# EAGLE design ton-bot (EAGLE 7.4.0)
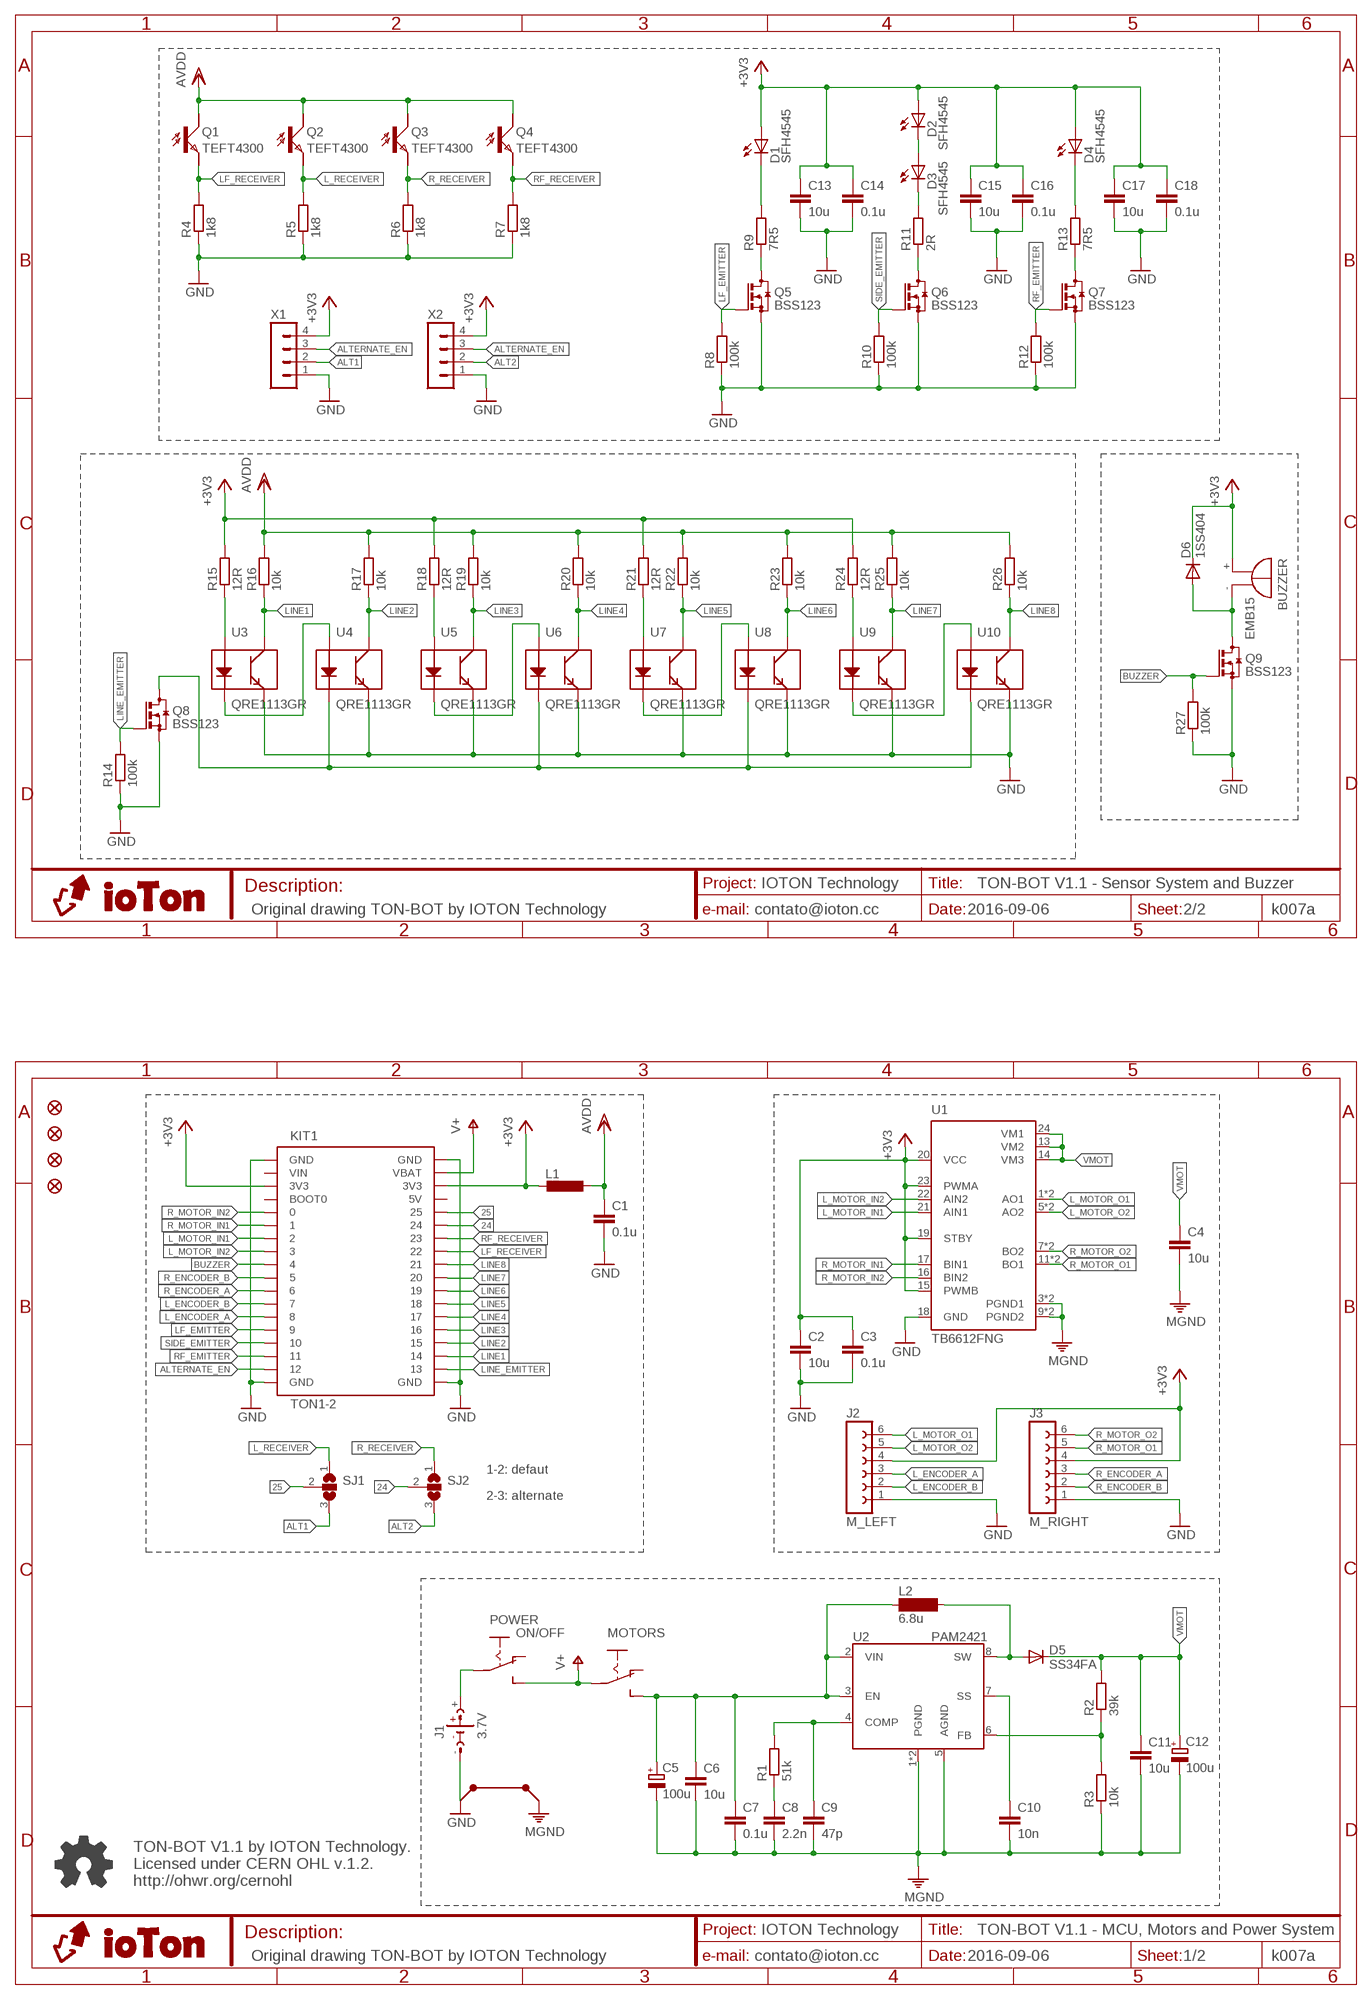
[diagram p0: schematic, sheet 1]

## Parts
BUZZER  EMB15  BMT1205XH7.5  [BMT1205XH7.5]
C1  0.1u  C-EUC0603  [C0603]
C2  10u  C-EUC0805  [C0805]
C3  0.1u  C-EUC0603  [C0603]
C4  10u  C-EUC0805  [C0805]
C5  100u  CPOL-EU153CLV-0505  [153CLV-0505]
C6  10u  C-EUC0805  [C0805]
C7  0.1u  C-EUC0603  [C0603]
C8  2.2n  C-EUC0603  [C0603]
C9  47p  C-EUC0603  [C0603]
C10  10n  C-EUC0603  [C0603]
C11  10u  C-EUC0805  [C0805]
C12  100u  CPOL-EU153CLV-0505  [153CLV-0505]
C13  10u  C-EUC0805  [C0805]
C14  0.1u  C-EUC0603  [C0603]
C15  10u  C-EUC0805  [C0805]
C16  0.1u  C-EUC0603  [C0603]
C17  10u  C-EUC0805  [C0805]
C18  0.1u  C-EUC0603  [C0603]
D1  SFH4545  SFH4545AK  [SFH4545-AK]
D2  SFH4545  SFH4545KA  [SFH4545-KA]
D3  SFH4545  SFH4545KA  [SFH4545-KA]
D4  SFH4545  SFH4545KA  [SFH4545-KA]
D5  SS34FA  DIODE-DO214BA  [DO214BA]
D6  1SS404  DIODE-SOD323-R  [SOD323-R]
J1  3.7V  BATTERY  [BATTERY]
J2  M_LEFT  FE06-12MM  [CON6-1_2MM]
J3  M_RIGHT  FE06-12MM  [CON6-1_2MM]
JP1  FIDUCIAL1X2  [FIDUCIAL-1X2]
JP2  FIDUCIAL1X2  [FIDUCIAL-1X2]
JP3  FIDUCIAL1X2  [FIDUCIAL-1X2]
JP4  FIDUCIAL1X2  [FIDUCIAL-1X2]
KIT1  TON1-2  [TON1-2]
L1  L-EUL0603  [L0603]
L2  6.8u  TYS6045  [TYS6045]
MOTORS  SWITCHS  [SWITCH]
POWER  ON/OFF  SWITCHS  [SWITCH]
Q1  TEFT4300  TEFT4300CE  [TEFT4300-CE]
Q2  TEFT4300  TEFT4300EC  [TEFT4300-EC]
Q3  TEFT4300  TEFT4300CE  [TEFT4300-CE]
Q4  TEFT4300  TEFT4300EC  [TEFT4300-EC]
Q5  BSS123  [SOT23]
Q6  BSS123  [SOT23]
Q7  BSS123  [SOT23]
Q8  BSS123  [SOT23]
Q9  BSS123  [SOT23]
R1  51k  R-EU_R0603  [R0603]
R2  39k  R-EU_R0603  [R0603]
R3  10k  R-EU_R0603  [R0603]
R4  1k8  R-EU_R0603  [R0603]
R5  1k8  R-EU_R0603  [R0603]
R6  1k8  R-EU_R0603  [R0603]
R7  1k8  R-EU_R0603  [R0603]
R8  100k  R-EU_R0603  [R0603]
R9  7R5  R-EU_R0805  [R0805]
R10  100k  R-EU_R0603  [R0603]
R11  2R  R-EU_R0805  [R0805]
R12  100k  R-EU_R0603  [R0603]
R13  7R5  R-EU_R0805  [R0805]
R14  100k  R-EU_R0603  [R0603]
R15  12R  R-EU_R0603  [R0603]
R16  10k  R-EU_R0603  [R0603]
R17  10k  R-EU_R0603  [R0603]
R18  12R  R-EU_R0603  [R0603]
R19  10k  R-EU_R0603  [R0603]
R20  10k  R-EU_R0603  [R0603]
R21  12R  R-EU_R0603  [R0603]
R22  10k  R-EU_R0603  [R0603]
R23  10k  R-EU_R0603  [R0603]
R24  12R  R-EU_R0603  [R0603]
R25  10k  R-EU_R0603  [R0603]
R26  10k  R-EU_R0603  [R0603]
R27  100k  R-EU_R0603  [R0603]
SJ1  SJ2W  [SJ_2]
SJ2  SJ2W  [SJ_2]
U1  TB6612FNG  [SSOP24]
U2  PAM2421  PAM242X  [SO-08EP]
U3  QRE1113GR  QRE1113  [QRE1113]
U4  QRE1113GR  QRE1113  [QRE1113]
U5  QRE1113GR  QRE1113  [QRE1113]
U6  QRE1113GR  QRE1113  [QRE1113]
U7  QRE1113GR  QRE1113  [QRE1113]
U8  QRE1113GR  QRE1113  [QRE1113]
U9  QRE1113GR  QRE1113  [QRE1113]
U10  QRE1113GR  QRE1113  [QRE1113]
X1  MA04-1  [PIN4-1]
X2  MA04-1  [PIN4-1]

## Nets
24: KIT1.EXT-2.6 SJ2.2
25: KIT1.EXT-2.5 SJ1.2
+3V3: BUZZER.+ C2.1 C3.1 C13.1 C14.1 C15.1 C16.1 C17.1 C18.1 D1.A D2.A D4.A D6.C J2.4 J3.4 KIT1.EXT-1.3(3V3) KIT1.EXT-2.3(3V3) L1.2 R15.2 R18.2 R21.2 R24.2 U1.15(PWMB) U1.19(STBY) U1.20(VCC) U1.23(PWMA) X1.4 X2.4
A_VDD: C1.1 L1.1 Q1.C Q2.C Q3.C Q4.C R16.2 R17.2 R19.2 R20.2 R22.2 R23.2 R25.2 R26.2 ; supply symbol labelled AVDD
ALT1: SJ1.3 X1.2
ALT2: SJ2.3 X2.2
ALTERNATE_EN: KIT1.EXT-1.17 X1.3 X2.3
BUZZER: KIT1.EXT-1.9 Q9.1(G) R27.2
FDSG: D5.A L2.2 U2.8(SW)
GND: C1.2 C2.2 C3.2 C13.2 C14.2 C15.2 C16.2 C17.2 C18.2 J1.- J2.1 J3.1 KIT1.EXT-1.1(GND) KIT1.EXT-1.18(GND) KIT1.EXT-2.1(GND) KIT1.EXT-2.18(GND) KIT1.GND1(GND) KIT1.GND2(GND) Q5.2(S) Q6.2(S) Q7.2(S) Q8.2(S) Q9.2(S) R4.1 R5.1 R6.1 R7.1 R8.1 R10.1 R12.1 R14.1 R27.1 U1.18(GND) U3.4(E) U4.4(E) U5.4(E) U6.4(E) U7.4(E) U8.4(E) U9.4(E) U10.4(E) X1.1 X2.1
L_ENCODER_A: J2.3 KIT1.EXT-1.13
L_ENCODER_B: J2.2 KIT1.EXT-1.12
L_MOTOR_IN1: KIT1.EXT-1.7 U1.21(AIN1)
L_MOTOR_IN2: KIT1.EXT-1.8 U1.22(AIN2)
L_MOTOR_O1: J2.6 U1.1(AO1) U1.2(AO1)
L_MOTOR_O2: J2.5 U1.5(AO2) U1.6(AO2)
L_RECEIVER: Q2.E R5.2 SJ1.1
LF_EMITTER: KIT1.EXT-1.14 Q5.1(G) R8.2
LF_RECEIVER: KIT1.EXT-2.8 Q1.E R4.2
LINE1: KIT1.EXT-2.16 R16.1 U3.3(C)
LINE2: KIT1.EXT-2.15 R17.1 U4.3(C)
LINE3: KIT1.EXT-2.14 R19.1 U5.3(C)
LINE4: KIT1.EXT-2.13 R20.1 U6.3(C)
LINE5: KIT1.EXT-2.12 R22.1 U7.3(C)
LINE6: KIT1.EXT-2.11 R23.1 U8.3(C)
LINE7: KIT1.EXT-2.10 R25.1 U9.3(C)
LINE8: KIT1.EXT-2.9 R26.1 U10.3(C)
LINE_EMITTER: KIT1.EXT-2.17 Q8.1(G) R14.2
LINE_K: Q8.3(D) U4.2(K) U6.2(K) U8.2(K) U10.2(K)
M_GND: C4.2 C5.- C6.2 C7.2 C8.2 C9.2 C10.2 C11.2 C12.- R3.1 U1.3(PGND1) U1.4(PGND1) U1.9(PGND2) U1.10(PGND2) U2.1(PGND) U2.5(AGND) U2.EXP(PGND) ; supply symbol labelled MGND
N$1: Q5.3(D) R9.1
N$2: Q6.3(D) R11.1
N$3: Q7.3(D) R13.1
N$4: BUZZER.- D6.A Q9.3(D)
N$8: R2.1 R3.2 U2.6(FB)
N$9: C10.1 U2.7(SS)
N$11: C8.1 R1.1
N$12: C9.1 R1.2 U2.4(COMP)
N$14: D2.K D3.A
N$15: D1.K R9.2
N$16: D4.K R13.2
N$17: J1.+ POWER.P
N$20: D3.K R11.2
N$33: R15.1 U3.1(A)
N$34: U3.2(K) U4.1(A)
N$35: U5.2(K) U6.1(A)
N$36: U7.2(K) U8.1(A)
N$37: U9.2(K) U10.1(A)
N$39: R24.1 U9.1(A)
N$42: R21.1 U7.1(A)
N$55: R18.1 U5.1(A)
R_ENCODER_A: J3.3 KIT1.EXT-1.11
R_ENCODER_B: J3.2 KIT1.EXT-1.10
R_MOTOR_IN1: KIT1.EXT-1.6 U1.17(BIN1)
R_MOTOR_IN2: KIT1.EXT-1.5 U1.16(BIN2)
R_MOTOR_O1: J3.5 U1.11(BO1) U1.12(BO1)
R_MOTOR_O2: J3.6 U1.7(BO2) U1.8(BO2)
R_RECEIVER: Q3.E R6.2 SJ2.1
RF_EMITTER: KIT1.EXT-1.16 Q7.1(G) R12.2
RF_RECEIVER: KIT1.EXT-2.7 Q4.E R7.2
SIDE_EMITTER: KIT1.EXT-1.15 Q6.1(G) R10.2
V+: KIT1.EXT-2.2(VBAT) MOTORS.P POWER.S
VIN_M: C5.+ C6.1 C7.1 L2.1 MOTORS.S U2.2(VIN) U2.3(EN)
VMOT: C4.1 C11.1 C12.+ D5.C R2.2 U1.13(VM2) U1.14(VM3) U1.24(VM1)
Unconnected: KIT1.EXT-1.4(BOOT0) MOTORS.O POWER.O

## Notes on the sheet
- TON-BOT V1.1 - Sensor System and Buzzer
- Original drawing TON-BOT by IOTON Technology | k007a
- 1-2: defaut
- 2-3: alternate
- TON-BOT V1.1 by IOTON Technology.
  Licensed under CERN OHL v.1.2.
  http://ohwr.org/cernohl
- TON-BOT V1.1 - MCU, Motors and Power System
- Original drawing TON-BOT by IOTON Technology | k007a

## Power pins joined to a net without a drawn wire
5V: KIT1.EXT-2.4(5V)
VIN: KIT1.EXT-1.2(VIN)

## Library data of the parts
BUZZER = buzzer:BMT1205XH7.5: MAGNETIC TRANSDUCER Source: Http:www.be-star.com; OC_FARNELL: unknown; OC_NEWARK: unknown
C1-C4 C6-C11 C13-C18 = rcl:C-EU: CAPACITOR, European symbol
C5 C12 = rcl:CPOL-EU: POLARIZED CAPACITOR, European symbol
D1-D4 = maze:SFH4545
D5 D6 = diode:DIODE-: DIODE
J1 = pololu:BATTERY: BATTERY CLIP
J2 J3 = pololu:FE06-1: FEMALE HEADER
JP1-JP4 = SparkFun:FIDUCIAL: Fiducial Alignment Points Various fiducial points for machine vision alignment.
KIT1 = ioton:TON1-2
L1 = rcl:L-EU: INDUCTOR, European symbol
L2 = ioton:TYS6045: INDUCTOR SMD power inductor; OC_FARNELL: unknown; OC_NEWARK: unknown
MOTORS POWER = pololu:SWITCH: SLIDING SWITCH 0.1" spacing through hole, vertical SPDT slide switch http://www.ladyada.net/library/pcb/eaglelibrary.html
Q1-Q4 = maze:TEFT4300
Q5-Q9 = transistor-small-signal:BSS123: N-CHANNEL MOS FET
R1-R27 = rcl:R-EU_: RESISTOR, European symbol
SJ1 SJ2 = jumper:SJ2W: SMD solder JUMPER
U1 = pololu:TB6612FNG
U2 = ioton:PAM242X
U3-U10 = pololu:QRE1113
X1 X2 = pololu:MA04-1: PIN HEADER

## Board
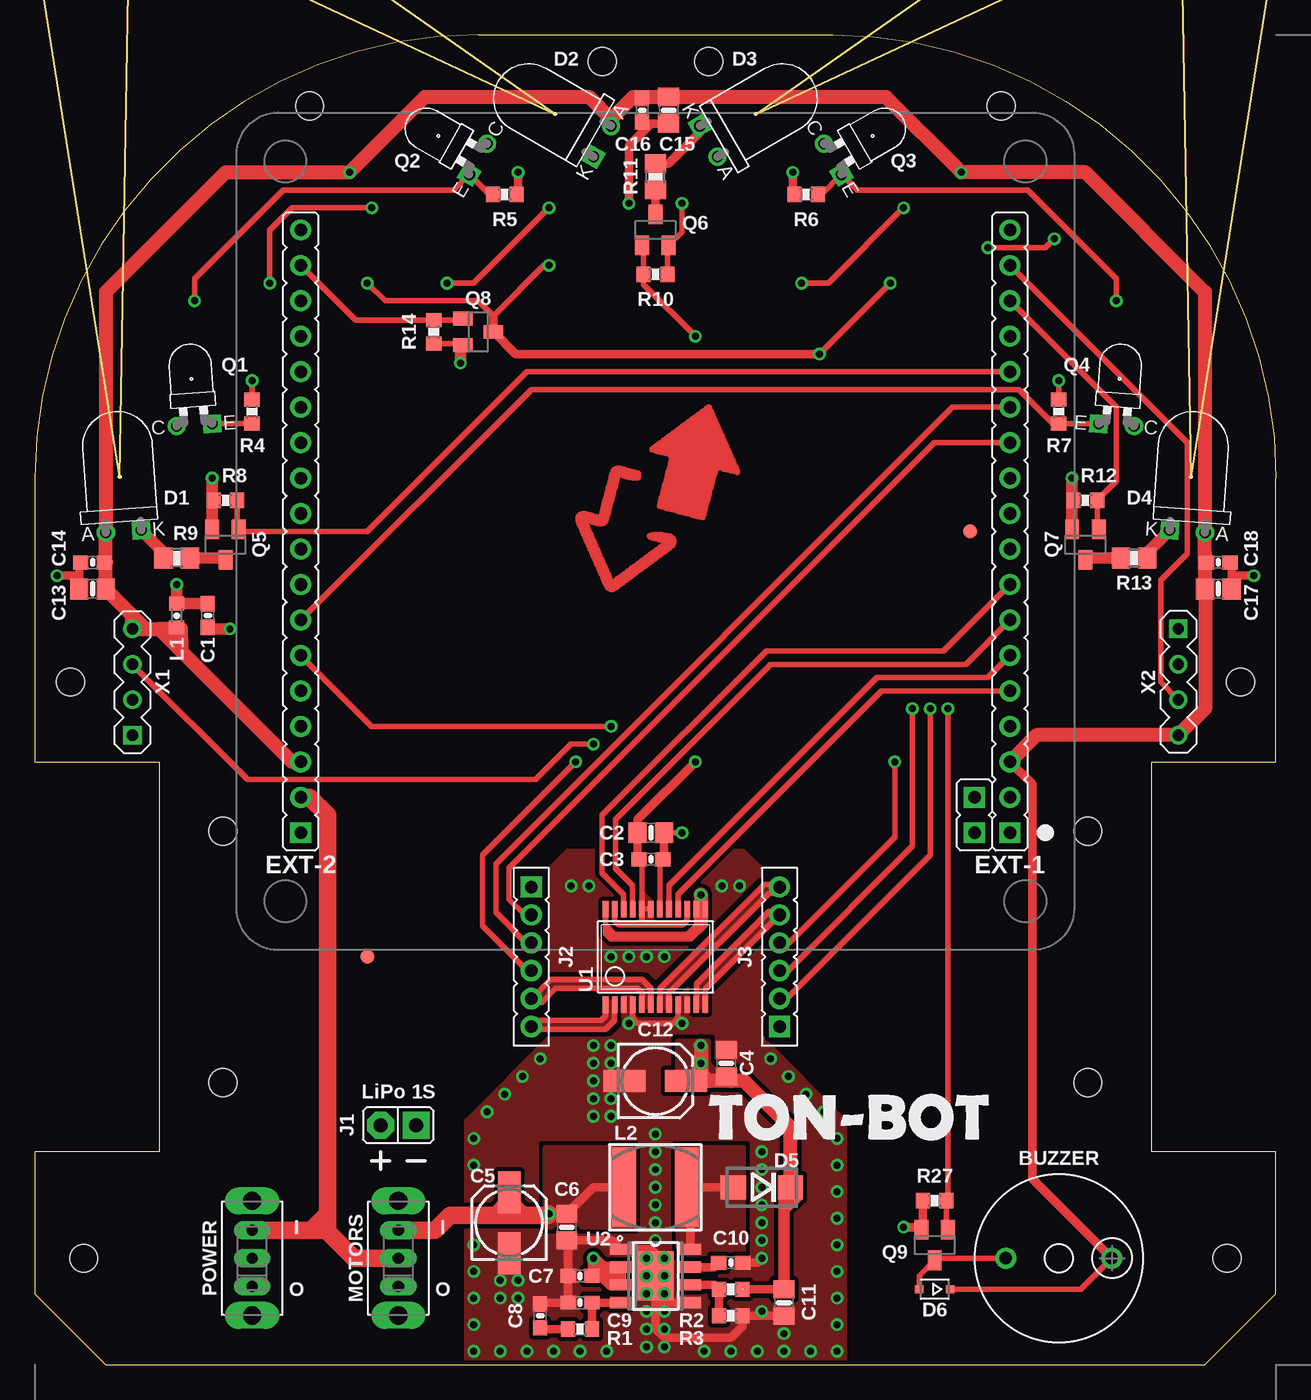
[diagram p1: board, top side]
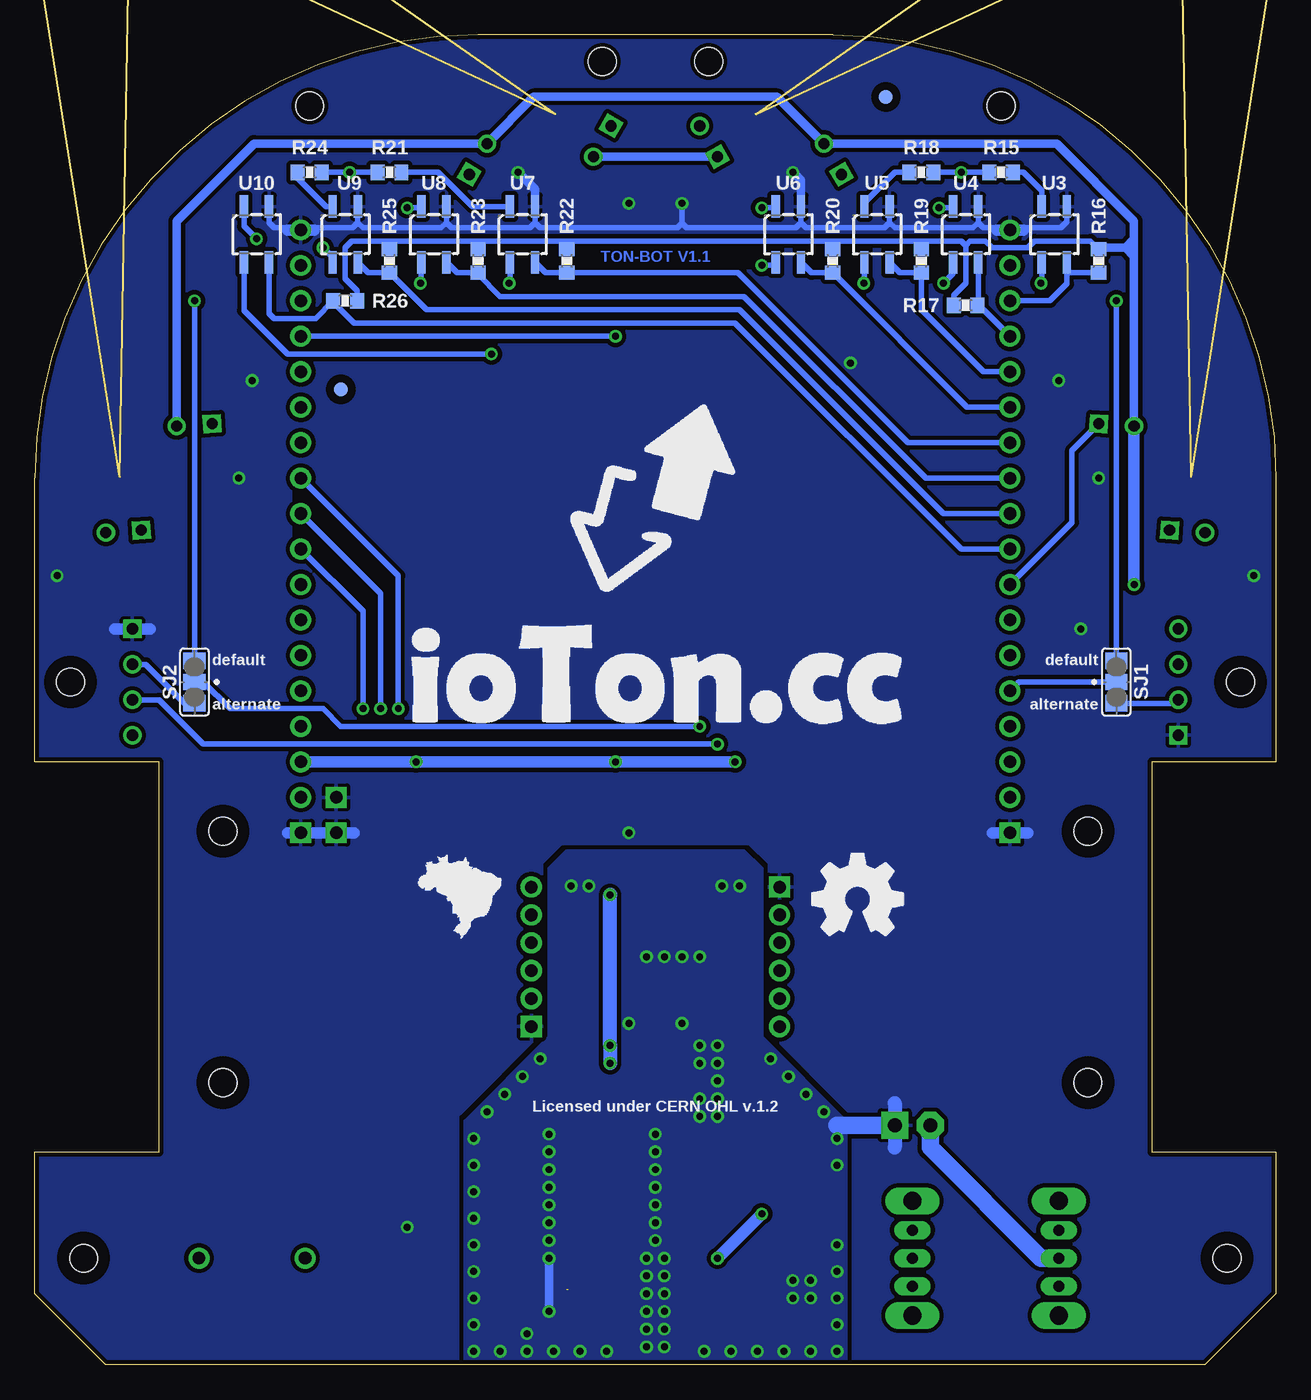
[diagram p2: board, bottom side, seen from below]

Size 88.9 x 95.25 mm. Coordinates in mm from the lower left corner, seen from the top.
Outline: 0,15.24 0,5.08 5.08,0 83.82,0 88.9,5.08 88.9,15.24 80.01,15.24 80.01,43.18 88.9,43.18 88.9,63.5 arc90 57.15,95.25 31.75,95.25 arc90 0,63.5 0,43.18 8.89,43.18 8.89,15.24 0,15.24
Copper layers (1*16): Top 0.035mm / dielectric 1.5mm / Bottom 0.035mm
Design rules "default": minimum track width 8mil, minimum drill 19mil, track to track 8mil, track to pad 8mil, pad to pad 8mil, via to via 8mil, smd to smd 8mil, copper to edge 10mil, drill to drill 8mil, minimum pad ring 10mil, minimum via ring 8mil, stop-mask expansion 4mil, vias tented up to drill 20mil, thermal gap 10mil
Holes 2 mm at 13.47,38.21 13.47,20.21 75.43,20.21 75.43,38.21 48.26,93.34 40.64,93.34 19.69,90.17 69.22,90.17 2.54,48.89 86.36,48.89 3.49,7.62 85.41,7.62
tRestrict: area 23.1,28.5 to 24.6,30; area 66.2,58.9 to 67.7,60.4
bRestrict: area 1.1,47.5 to 4,50.3; area 84.9,47.5 to 87.8,50.3; area 2.1,6.2 to 4.9,9; area 84,6.2 to 86.8,9; area 12,18.8 to 14.9,21.6; area 12,36.8 to 14.9,39.6; area 74,36.8 to 76.9,39.6; area 74,18.8 to 76.9,21.6; area 69.5,61.9 to 70.2,62.5; area 69.5,59.4 to 70.2,60; area 37.8,78.7 to 38.4,79.4; area 27.2,90.1 to 28.7,91.6; 1 more areas

### Footprints (pad centres in the part's own frame; a part is rotated, then mirrored left to right if it is on the bottom)
BMT1205XH7.5 = drill 0.9 pad 1.5: + 3.8,0; - -3.8,0
C0603 = smd 1.1 x 1: 1 -0.85,0; 2 0.85,0
C0805 = smd 1.3 x 1.5: 1 -0.95,0; 2 0.95,0
153CLV-0505 = smd 3 x 1.6: + 2.2,0; - -2.2,0
SFH4545-AK = drill 0.8: A -1.27,0 | drill 0.8 square: K 1.27,0
SFH4545-KA = drill 0.8: A 1.27,0 | drill 0.8 square: K -1.27,0
DO214BA = smd 1.8 x 1.7: A 2.05,0; C -2.05,0
SOD323-R = smd 0.6 x 0.6: A 1.1,0; C -1.1,0
BATTERY = drill 1 pad 1.93 octagon: + 0,1.27 | drill 1 pad 1.93 square: - 0,-1.27
CON6-1_2MM = drill 0.9 pad 1.524 square: 1 -5,0 | drill 0.9 pad 1.524: 2 -3,0; 3 -1,0; 4 1,0; 5 3,0; 6 5,0
FIDUCIAL-1X2 = smd 1 x 1: 1 0,0
TON1-2 = drill 0.9 pad 1.5 square: EXT-1.1 25.4,-21.59; EXT-2.1 -25.4,-21.59; GND1 22.86,-21.59; GND2 22.86,-19.05 | drill 0.9 pad 1.5: EXT-1.2 25.4,-19.05; EXT-1.3 25.4,-16.51; EXT-1.4 25.4,-13.97; EXT-1.5 25.4,-11.43; EXT-1.6 25.4,-8.89; EXT-1.7 25.4,-6.35; EXT-1.8 25.4,-3.81; EXT-1.9 25.4,-1.27; EXT-1.10 25.4,1.27; EXT-1.11 25.4,3.81; EXT-1.12 25.4,6.35; EXT-1.13 25.4,8.89; EXT-1.14 25.4,11.43; EXT-1.15 25.4,13.97; EXT-1.16 25.4,16.51; EXT-1.17 25.4,19.05; EXT-1.18 25.4,21.59; EXT-2.2 -25.4,-19.05; EXT-2.3 -25.4,-16.51; EXT-2.4 -25.4,-13.97; EXT-2.5 -25.4,-11.43; EXT-2.6 -25.4,-8.89; EXT-2.7 -25.4,-6.35; EXT-2.8 -25.4,-3.81; EXT-2.9 -25.4,-1.27; EXT-2.10 -25.4,1.27; EXT-2.11 -25.4,3.81; EXT-2.12 -25.4,6.35; EXT-2.13 -25.4,8.89; EXT-2.14 -25.4,11.43; EXT-2.15 -25.4,13.97; EXT-2.16 -25.4,16.51; EXT-2.17 -25.4,19.05; EXT-2.18 -25.4,21.59
L0603 = smd 1 x 1.1: 1 -0.85,0; 2 0.85,0
TYS6045 = smd 5.7 x 1.7: 1 0,-2.25; 2 0,2.25
SWITCH = drill 0.8 pad 1.27 long: O -2,0; P 0,0; S 2,0 | drill 1.3 long: P$1 -4.1,0; P$2 4.1,0
TEFT4300-CE = drill 0.8: C -1.27,0 | drill 0.8 square: E 1.27,0
TEFT4300-EC = drill 0.8: C 1.27,0 | drill 0.8 square: E -1.27,0
SOT23 = smd 1 x 1.4: 1 -0.95,-1.1; 2 0.95,-1.1; 3 0,1.1
R0603 = smd 1 x 1.1: 1 -0.85,0; 2 0.85,0
R0805 = smd 1.3 x 1.5: 1 -0.95,0; 2 0.95,0
SJ_2 = smd 1.168 x 1.6: 1 -1.524,0; 2 0,0; 3 1.524,0
SSOP24 = smd 0.4 x 1.2: 1 -3.575,-3.42; 2 -2.925,-3.42; 3 -2.275,-3.42; 4 -1.625,-3.42; 5 -0.975,-3.42; 6 -0.325,-3.42; 7 0.325,-3.42; 8 0.975,-3.42; 9 1.625,-3.42; 10 2.275,-3.42; 11 2.925,-3.42; 12 3.575,-3.42; 13 3.575,3.42; 14 2.925,3.42; 15 2.275,3.42; 16 1.625,3.42; 17 0.975,3.42; 18 0.325,3.42; 19 -0.325,3.42; 20 -0.975,3.42; 21 -1.625,3.42; 22 -2.275,3.42; 23 -2.925,3.42; 24 -3.575,3.42
SO-08EP = smd 0.802 x 1.505: 1 -1.905,-2.5; 2 -0.635,-2.5; 3 0.635,-2.5; 4 1.905,-2.5; 5 1.905,2.5; 6 0.635,2.5; 7 -0.635,2.5; 8 -1.905,2.5 | smd 3.502 x 2.613: EXP 0,0
QRE1113 = smd 1.6 x 0.6: 1 -2,-0.9; 2 2,-0.9; 3 2,0.9; 4 -2,0.9
PIN4-1 = drill 0.8 square: 1 -3.81,0 | drill 0.8: 2 -1.27,0; 3 1.27,0; 4 3.81,0

### Placement (x,y rotation side)
BUZZER  73.34,7.62 0 top
C1  12.38,53.66 270 top
C2  44.12,38.1 0 top
C3  44.12,36.2 0 top
C4  49.53,21.59 90 top
C5  33.97,10.16 90 top
C6  38.1,9.84 270 top
C7  39.05,6.35 180 top
C8  36.2,3.49 90 top
C9  39.05,4.45 180 top
C10  49.85,7.3 0 top
C11  53.66,4.45 270 top
C12  44.45,20.32 0 top
C13  4.13,55.56 180 top
C14  4.13,57.47 180 top
C15  45.4,89.85 270 top
C16  43.5,89.85 270 top
C17  84.77,55.56 0 top
C18  84.77,57.47 0 top
D1  6.35,59.69 4 top
D2  40.64,87.63 60 top
D3  48.26,87.63 300 top
D4  82.55,59.69 356 top
D5  52.07,12.7 180 top
D6  64.45,5.4 180 top
J1  26.04,17.15 90 top
J2  35.56,29.21 270 top
J3  53.34,29.21 90 top
JP1  66.99,59.69 0 top
JP2  23.81,29.21 0 top
JP3  66.99,69.85 0 bottom
JP4  27.94,90.81 0 bottom
KIT1  44.45,59.69 0 top
L1  10.16,53.66 270 top
L2  44.45,12.7 270 top
MOTORS  26.04,7.62 90 top
POWER  15.56,7.62 90 top
Q1  11.43,67.31 4 top
Q2  31.75,86.36 60 top
Q3  57.15,86.36 300 top
Q4  77.47,67.31 356 top
Q5  13.65,58.74 180 top
Q6  44.45,81.28 0 top
Q7  75.25,58.74 180 top
Q8  31.75,73.98 270 top
Q9  64.45,8.57 180 top
R1  39.05,2.54 0 top
R2  49.85,5.4 0 top
R3  49.85,3.49 180 top
R4  15.56,68.26 270 top
R5  33.66,83.82 180 top
R6  55.25,83.82 0 top
R7  73.34,68.26 270 top
R8  13.65,61.91 0 top
R9  10.16,57.78 180 top
R10  44.45,78.11 180 top
R11  44.45,85.09 90 top
R12  75.25,61.91 0 top
R13  78.74,57.78 0 top
R14  28.58,73.98 90 top
R15  19.69,85.41 180 bottom
R16  12.7,79.06 90 bottom
R17  22.23,75.88 180 bottom
R18  25.4,85.41 0 bottom
R19  25.4,79.06 90 bottom
R20  31.75,79.06 90 bottom
R21  63.5,85.41 180 bottom
R22  50.8,79.06 90 bottom
R23  57.15,79.06 90 bottom
R24  69.22,85.41 0 bottom
R25  63.5,79.06 90 bottom
R26  66.68,76.2 0 bottom
R27  64.45,11.75 0 top
SJ1  11.43,48.89 270 bottom
SJ2  77.47,48.89 270 bottom
U1  44.45,29.21 0 top
U2  44.45,6.35 270 top
U3  15.88,80.96 270 bottom
U4  22.23,80.96 270 bottom
U5  28.58,80.96 270 bottom
U6  34.93,80.96 270 bottom
U7  53.98,80.96 270 bottom
U8  60.33,80.96 270 bottom
U9  66.68,80.96 270 bottom
U10  73.03,80.96 270 bottom
X1  6.98,48.89 90 top
X2  81.92,48.89 270 top

### Tracks (layer width: path | path; a pad name or v marks a point on that pad's centre or on a via)
24  (via drill 0.5)
  Top 0.406: v41.28,45.72 24.13,45.72 KIT1.EXT-2.6
  Bottom 0.406: SJ2.2 76.84,48.89 74.93,46.99 68.26,46.99 66.99,45.72 v41.28,45.72
25
  Bottom 0.406: SJ1.2 18.42,48.89 KIT1.EXT-2.5
+3V3  (via drill 0.5)
  Top 0.406: U1.23 41.53,31.81 41.85,31.48 43.48,31.48 | 43.48,31.48 46.4,31.48 46.73,31.81 U1.15 | U1.19 U1.20 | 43.48,31.48 U1.20 | C2.1 | D6.C 74.92,5.4 BUZZER.+ | J2.4 35.29,28.21 32.07,31.43 32.07,36.51 v38.73,43.18 | J3.4 54.02,30.21 61.59,37.78 v61.59,43.18 | U1.20 43.48,36 C3.1
  Top 0.61: C2.1 43.18,39.05 v47.31,43.18 | C15.1 45.55,90.8 45.55,90.81 | KIT1.EXT-1.3 71.44,41.59 71.44,13.33 BUZZER.+ | C2.1 43.18,36.3 C3.1 | C16.1 43.5,90.8 | 10.16,52.7 L1.2 10.16,52.7 10.48,52.39 | C18.1 83.92,58 83.82,58.1
  Top 0.813: 9.53,52.07 10.48,52.07
  Top 1.016: 41.28,89.22 42.86,90.8 43.5,90.8 C15.1 60.96,90.8 v66.36,85.41 75.25,85.41 83.82,76.84 D4.A 83.82,58.1 83.82,57.47 | 6.98,53.66 X1.4 7.94,52.7 | KIT1.EXT-1.3 71.75,45.09 X2.4 83.82,46.99 C17.1 83.82,57.37 C18.1 | 8.89,52.7 10.16,52.7 10.48,52.7 10.48,52.39 10.48,52.07 10.48,51.12 | 8.89,52.7 9.53,52.07 10.48,51.12 | KIT1.EXT-2.3 18.42,43.18 10.48,51.12 | D1.A 5.08,76.83 13.65,85.41 v22.54,85.41 27.94,90.81 39.69,90.81 41.28,89.22 | 41.28,89.22 D2.A | 7.94,52.7 C13.1 5.08,57.47 | 7.94,52.7 8.89,52.7 | 5.08,57.47 D1.A | D1.A | C14.1 5.08,57.47
  Bottom 0.406: R15.2 v22.54,85.41 R18.2 | R21.2 v66.36,85.41 R24.2
  Bottom 0.813: KIT1.EXT-1.3 v61.59,43.18 v47.31,43.18 v38.73,43.18
  pour Top (no thermals): 43.48,31.81 43.48,33.76 44.12,33.11 44.12,31.81 44.45,31.48 43.15,31.48
A_VDD  (via drill 0.5)
  Top 0.813: C1.1 L1.1 v10.16,55.88
  Bottom 0.406: 56.99,80.49 63.5,80.49 | 63.5,80.49 66.2,80.49 66.68,80.01 66.68,77.79 65.83,76.94 R26.2 | R23.2 57.15,80.33 56.99,80.49 | 25.4,80.49 22.54,80.49 22.23,80.17 | 25.4,80.49 31.75,80.49 | 31.75,80.49 50.8,80.49 | 50.8,80.49 56.99,80.49 | R20.2 31.75,80.49 | R19.2 25.4,80.49 | 22.23,80.17 21.91,80.49 20.8,80.49 20.32,80.01 17.78,80.01 17.3,80.49 13.28,80.49 R16.2 | 22.23,80.17 22.23,77.47 23.08,76.62 R17.2 | R22.2 50.8,80.49 | R25.2 63.5,80.49
  Bottom 0.61: 10.16,80.65 10.16,79.38 | 10.16,79.38 Q1.C | 10.8,80.01 10.16,79.38 | 10.16,80.65 10.8,80.01 12.6,80.01 R16.2 | Q4.C 78.73,81.92 73.2,87.46 Q3.C 53.17,90.81 35.73,90.81 Q2.C 15.71,87.46 10.16,81.92 10.16,80.65
  Bottom 0.813: Q1.C v10.16,55.88
ALT1
  Bottom 0.406: SJ1.3 7.24,47.37 X1.2
ALT2
  Bottom 0.406: X2.2 80.96,50.16 78.17,47.37 SJ2.3
ALTERNATE_EN  (via drill 0.5)
  Top 0.406: X1.3 15.24,41.91 35.88,41.91 38.42,44.45 v40.01,44.45 | KIT1.EXT-1.17 82.55,66.04 82.55,58.1 80.65,56.2 80.65,48.89 X2.3
  Bottom 0.406: X2.3 80.01,47.62 76.84,44.45 v40.01,44.45
BUZZER  (via drill 0.5)
  Top 0.406: Q9.1 65.3,9.77 R27.2 65.41,11.85 v65.41,46.99
  Bottom 0.406: KIT1.EXT-1.9 65.41,53.98 v65.41,46.99
FDSG
  Top 0.61: U2.8 46.95,12.45 L2.2 D5.A
  pour Top (isolate 0.305, no thermals): 46.04,15.56 46.04,7.94 50.8,7.94 50.8,15.56
GND  (via drill 0.5)
  Top 0.406: C2.2 v46.36,38.1 | v46.36,83.19 46.36,81.13 Q6.2 45.3,80.08 R10.1 | v15.56,70.48 R4.1 | v73.34,70.48 R7.1 | 30.48,72.86 Q8.2 30.55,73.13 R14.1 | U1.18 44.78,36 C3.2
  Top 0.61: 85.72,56.52 C17.2 | v87.31,56.52 85.72,56.52 | v42.55,83.19 42.55,87.31 44.13,88.9 | 3.18,56.52 v1.59,56.52 | v34.61,85.41 34.61,83.92 R5.1 | v54.29,85.41 v54.3,85.41 54.3,83.92 R6.1 | v62.23,9.84 63.5,9.84 Q9.2 63.6,9.77 R27.1 | 85.72,56.52 85.72,57.37 C18.2 | C15.2 44.13,88.9 | 44.13,88.9 43.6,88.9 C16.2 | C2.2 45.08,36.3 C3.2 | 3.18,56.52 3.18,57.37 C14.2 | 3.18,56.52 C13.2
  Top 0.813: v30.48,71.75 30.48,72.86 | v74.3,63.5 74.3,61.91 R12.1 74.3,61.81 Q7.2 | v12.7,63.5 12.7,61.91 R8.1 12.7,61.81 Q5.2 | v13.97,52.7 12.49,52.7 C1.2
  Bottom 0.406: 21.33,81.81 20.96,81.44 19.21,81.44 KIT1.EXT-2.18 18.89,81.44 15.4,81.44 14.98,81.86 U3.4 | U4.4 21.33,81.81 | 27.68,81.81 27.31,81.44 21.7,81.44 21.33,81.81 | U5.4 27.68,81.81 | 34.03,81.81 33.66,81.44 28.05,81.44 27.68,81.81 | U6.4 34.03,81.81 | U7.4 53.08,81.81 | 53.08,81.81 52.71,81.44 42.86,81.44 42.55,81.76 | U8.4 59.43,81.81 | 59.43,81.81 59.06,81.44 53.45,81.44 53.08,81.81 | U9.4 65.78,81.81 | 65.78,81.81 65.41,81.44 59.8,81.44 59.43,81.81 | U10.4 72.12,81.81 71.75,81.44 70.01,81.44 KIT1.EXT-1.18 69.69,81.44 66.15,81.44 65.78,81.81 | 34.03,81.81 34.4,81.44 42.23,81.44 42.55,81.76 | v42.55,83.19 42.55,81.76
  Bottom 0.61: U6.4 34.03,84.83 v34.61,85.41 | U7.4 53.08,84.19 v54.29,85.41
  Bottom 0.813: 18.1,81.28 KIT1.EXT-2.18 20,81.28 | 68.9,81.28 KIT1.EXT-1.18 70.8,81.28 | 80.65,52.7 83.19,52.7 | 70.8,38.1 66.04,38.1 | 20.32,38.1 17.78,38.1
  Bottom 1.016: 27.31,18.73 J1.- 27.31,15.56
  pour Bottom (isolate 0.305, rank 3): 0,95.25 0,0 88.9,0 88.9,95.25
L_ENCODER_A
  Top 0.406: J2.3 35.2,30.21 33.02,32.38 33.02,35.88 65.72,68.58 KIT1.EXT-1.13
L_ENCODER_B
  Top 0.406: J2.2 35.1,32.21 33.97,33.34 33.97,35.56 64.45,66.04 KIT1.EXT-1.12
L_MOTOR_IN1
  Top 0.406: U1.21 42.83,34.31 41.59,35.55 41.59,39.05 52.71,50.16 66.68,50.16 KIT1.EXT-1.7
L_MOTOR_IN2
  Top 0.406: U1.22 42.18,33.69 40.64,35.23 40.64,39.37 52.39,51.12 65.09,51.12 KIT1.EXT-1.8
L_MOTOR_O1
  Top 0.406: U1.2 41.53,24.66 40.88,24.01 35.68,24.01 35.56,24.12 J2.6 36.01,24.66 40.55,24.66 40.88,24.98 U1.1
  pour Top (no thermals): 40.88,25.96 41.53,25.96 41.53,24.66 40.88,24.01 35.68,24.01 35.35,24.34 35.68,24.66 40.55,24.66 40.88,24.98
L_MOTOR_O2
  Top 0.406: U1.6 44.12,26.94 43.48,27.59 36.94,27.59 J2.5 35.81,25.96 36.33,25.96 37.3,26.94 43.15,26.94 43.48,26.61 U1.5
  pour Top (no thermals): 44.12,25.64 43.48,25.64 43.48,26.61 43.15,26.94 37.3,26.94 36.33,25.96 36,25.96 35.68,26.29 36.98,27.59 43.48,27.59 44.12,26.94
L_RECEIVER  (via drill 0.5)
  Top 0.406: R5.2 32.56,83.82 Q2.E 29.99,84.14 17.78,84.14 11.43,77.79 v11.43,76.2
  Bottom 0.406: SJ1.1 v11.43,76.2
LF_EMITTER
  Top 0.406: KIT1.EXT-1.14 35.24,71.12 23.81,59.69 14.75,59.69 Q5.1 14.5,59.94 R8.2
LF_RECEIVER
  Top 0.406: R4.2 12.71,67.41 Q1.E
  Bottom 0.406: KIT1.EXT-2.8 14.61,60.33 14.61,65.49 Q1.E
LINE1
  Bottom 0.406: 14.98,78.47 U3.3 14.98,78.42 | KIT1.EXT-2.16 16.19,76.2 14.98,77.42 14.98,78.42 | R16.1 14.76,78.21 14.98,78.42
LINE2
  Bottom 0.406: U4.3 21.33,75.93 R17.1 21.27,75.88 KIT1.EXT-2.15
LINE3
  Bottom 0.406: KIT1.EXT-2.14 20.96,71.12 25.4,75.56 R19.1 26.92,78.21 U5.3
LINE4
  Bottom 0.406: U6.3 33.27,78.21 R20.1 22.12,68.58 KIT1.EXT-2.13
LINE5
  Bottom 0.406: KIT1.EXT-2.12 26.35,66.04 38.52,78.21 R22.1 52.32,78.21 U7.3
LINE6
  Bottom 0.406: KIT1.EXT-2.11 25.08,63.5 38.1,76.52 55.56,76.52 57.15,78.11 R23.1 58.67,78.21 U8.3
LINE7
  Bottom 0.406: KIT1.EXT-2.10 23.81,60.96 38.42,75.56 60.86,75.56 R25.1 65.02,78.21 U9.3
LINE8
  Bottom 0.406: U10.3 72.12,75.3 71.75,74.93 68.8,74.93 R26.1 67.53,76.1 66.04,74.61 38.73,74.61 22.54,58.42 KIT1.EXT-2.9
LINE_EMITTER
  Top 0.406: Q8.1 30.55,74.83 R14.2 22.96,74.83 KIT1.EXT-2.17
LINE_K  (via drill 0.5)
  Top 0.406: v23.81,77.47 25.08,76.2 31.75,76.2 32.85,75.1 36.49,78.74 v36.83,78.74 | v61.28,77.47 v56.2,72.39
  Top 0.61: v56.2,72.39 34.44,72.39 Q8.3 32.85,75.1
  Bottom 0.406: U4.2 23.13,78.16 v23.81,77.47 | v36.83,78.74 36.05,78.74 U6.2 | U10.2 73.93,75.51 70.8,72.39 v56.2,72.39 | U8.2 61.23,77.52 v61.28,77.47
M_GND  (via drill 0.5)
  Top 0.406: U1.4 42.83,24.8 43.18,24.45 45.72,24.45 46.08,24.8 U1.9
  Top 0.61: U2.5 44.77,4.45 44.45,4.76 U2.EXP | U2.EXP 44.45,7.94 44.13,8.26 U2.1 41.31,8.89 C6.2 38.2,8.79 C7.2 C9.2 36.3,4.45 C8.2 | U2.EXP 44.45,2.54 45.09,1.91 49.85,1.91 50.7,2.76 R3.1 | C10.2 51.75,7.3 v52.07,7.62 | 50.8,3.5 52.07,3.5 | 52.07,3.5 C11.2 | v52.07,3.81 52.07,3.5
  Bottom 0.61: v52.07,7.62 v52.07,3.81
  Bottom 1.27: 31.43,17.15 27.31,17.15
  other vias: 39.69,34.29 49.21,34.29 52.07,12.7 52.07,11.43 52.07,10.16 52.07,13.97 52.07,15.24 44.45,15.24 44.45,13.97 44.45,12.7 44.45,11.43 44.45,10.16 43.82,7.62 45.09,7.62 43.82,6.35 45.09,6.35 45.09,5.08 43.82,5.08 44.45,8.89 43.82,3.81 45.09,3.81 45.09,2.54 43.82,2.54 53.66,2.22 47.94,0.95 45.09,1.27 43.82,1.27 40.96,0.95 44.45,16.51 52.07,16.51 52.07,8.89 55.56,0.96 34.61,6.03 33.34,4.76 33.34,6.03 34.61,4.76 33.34,0.96 31.43,0.96 49.85,0.96 51.75,0.96 53.66,0.96 39.05,0.95 37.15,0.95 35.24,0.95 41.28,21.59 41.28,22.86 41.28,19.05 41.28,17.78 40.01,17.78 40.01,19.05 40.01,20.32 40.01,21.59 40.01,22.86 42.55,24.45 46.36,24.45 57.47,0.96 31.43,2.86 31.43,4.77 31.43,6.67 31.43,8.57 57.47,2.86 57.47,4.77 57.47,6.67 57.47,8.57 57.47,10.48 57.47,12.39 57.47,14.29 57.47,16.2 56.52,18.1 55.25,19.37 53.98,20.64 52.71,21.91 36.2,21.91 34.93,20.64 33.66,19.37 32.39,18.1 31.43,16.2 31.43,14.29 38.42,34.29 50.48,34.29 45.09,29.21 43.82,29.21 42.55,29.21 41.28,29.21
  pour Top (isolate 0.305, rank 2, no thermals): 36.83,23.5 30.8,17.46 30.8,0 58.1,0 58.1,17.46 52.07,23.5 52.07,35.56 50.8,36.83 38.1,36.83 36.83,35.56
  pour Bottom (isolate 0.305, rank 2, no thermals): 36.83,35.56 36.83,23.5 30.8,17.46 30.8,0 58.1,0 58.1,17.46 52.07,23.5 52.07,35.56 50.8,36.83 38.1,36.83
N$1
  Top 0.61: Q5.3 13.51,57.78
  Top 0.813: 13.51,57.78 R9.1
N$2
  Top 0.61: R11.1 Q6.3
N$3
  Top 0.61: Q7.3 75.4,57.78
  Top 0.813: 75.4,57.78 R13.1
N$4
  Top 0.406: BUZZER.- 64.6,7.62 Q9.3 63.35,6.37 D6.A
N$8
  Top 0.61: R3.2 R2.1 48.68,5.71 U2.6
N$9
  Top 0.61: U2.7 48.68,6.98 C10.1
N$11
  Top 0.61: R1.1 36.3,2.54 C8.1
N$12
  Top 0.61: R1.2 C9.1 U2.4
N$14
  Bottom 0.61: D2.K D3.A
N$15
  Top 0.813: R9.2 9.21,58.19 D1.K
N$16
  Top 0.813: R13.2 79.69,58.19 D4.K
N$17
  Bottom 1.27: J1.+ 24.77,15.56 16.83,7.62 POWER.P
N$20
  Top 0.61: R11.2 45.4,86.04 47.62,88.27 D3.K
N$33
  Bottom 0.406: R15.1 18.1,85.41 16.78,84.09 U3.1 16.78,82.76
N$34  (via drill 0.5 pad 0.25)
  Top 0.406: v16.83,77.47 16.83,81.28 18.42,82.87 v24.13,82.87
  Bottom 0.406: 23.08,82.96 U4.1 23.22,82.87 v24.13,82.87 | U3.2 16.78,77.52 v16.83,77.47
N$35  (via drill 0.5 pad 0.25)
  Top 0.406: v29.53,77.47 31.43,77.47 v36.83,82.87
  Bottom 0.406: v29.53,77.47 29.48,77.52 U5.2 29.48,79.16 | v36.83,82.87 35.92,82.87 U6.1
N$36  (via drill 0.5)
  Top 0.406: v54.93,77.47 56.83,77.47 v62.23,82.87
  Bottom 0.406: U7.2 54.88,77.52 v54.93,77.47 | v62.23,82.87 61.32,82.87 U8.1
N$37  (via drill 0.5)
  Top 0.406: v68.26,80.01 72.39,80.01 v73.03,80.65
  Bottom 0.406: U9.2 67.58,79.32 v68.26,80.01 | U10.1 73.93,81.55 v73.03,80.65
N$39
  Bottom 0.406: U9.1 68.04,82.96 70.06,84.99 R24.1
N$42
  Bottom 0.406: U7.1 57.56,82.96 60.01,85.41 R21.1
N$55
  Bottom 0.406: U5.1 29.48,83.24 27.31,85.41 R18.1
R_ENCODER_A  (via drill 0.5)
  Top 0.406: v62.87,46.99 62.87,37.15 53.93,28.21 J3.3
  Bottom 0.406: v62.87,46.99 62.87,56.52 KIT1.EXT-1.11
R_ENCODER_B  (via drill 0.5)
  Top 0.406: v64.14,46.99 64.14,36.51 53.83,26.21 J3.2
  Bottom 0.406: v64.14,46.99 64.14,55.25 KIT1.EXT-1.10
R_MOTOR_IN1
  Top 0.406: U1.17 45.43,34.31 60.33,49.21 68.26,49.21 KIT1.EXT-1.6
R_MOTOR_IN2
  Top 0.406: U1.16 46.08,33.69 60.64,48.26 KIT1.EXT-1.5
R_MOTOR_O1
  Top 0.406: U1.11 47.38,27.26 52.58,32.46 53.09,32.46 J3.5 48.03,26.89 U1.12
  pour Top (no thermals): 47.38,25.64 48.03,25.64 48.03,26.94 53.23,32.13 53.23,32.46 52.58,32.46 47.38,27.26
R_MOTOR_O2
  Top 0.406: U1.7 44.78,26.94 52.25,34.41 53.14,34.41 J3.6 52.89,33.76 52.58,33.76 45.43,26.61 U1.8
  pour Top (no thermals): 44.78,25.64 45.43,25.64 45.43,26.61 52.58,33.76 53.23,33.76 53.55,34.09 53.23,34.41 52.25,34.41 44.78,26.94
R_RECEIVER  (via drill 0.5)
  Top 0.406: v77.47,76.2 77.47,77.79 71.12,84.14 58.91,84.14 Q3.E 56.34,83.82 R6.2
  Bottom 0.406: SJ2.1 v77.47,76.2
RF_EMITTER
  Top 0.406: KIT1.EXT-1.16 77.47,68.58 77.47,63.29 R12.2 76.1,59.94 Q7.1
RF_RECEIVER
  Top 0.406: KIT1.EXT-2.7 35.56,69.85 70.48,69.85 72.92,67.41 R7.2 76.19,67.41 Q4.E
SIDE_EMITTER  (via drill 0.5)
  Top 0.406: Q6.1 43.6,80.08 R10.2 43.6,77.37 v47.31,73.66
  Bottom 0.406: KIT1.EXT-1.15 v47.31,73.66
V+
  Top 1.27: MOTORS.P 22.86,7.62 21.91,8.57 20.96,9.53 | KIT1.EXT-2.2 19.69,40.64 20.96,39.37 20.96,10.8 | 20.96,10.8 20.96,9.53 | 19.78,9.62 20.96,10.8 | POWER.S 20.86,9.62 20.96,9.53
VIN_M  (via drill 0.5)
  Top 0.61: L2.1 40.01,12.7 C6.1 v36.83,10.8 | C7.1 40.01,6.35
  Top 0.813: 41.95,6.35 40.64,6.35 41.28,5.71 U2.3 | U2.3 40.05,7.62 v40.01,7.62 40.01,6.98 | U2.3 U2.2 40.01,6.98 | 40.01,6.98 40.01,6.35
  Top 1.27: MOTORS.S 28.67,9.62 29.76,10.71 33.02,10.71 | 33.02,10.71 34.93,10.71 | 34.93,10.71 36.74,10.71 v36.83,10.8 | 33.97,11.66 33.02,10.71 | C5.+ 33.97,11.66 | 33.97,11.66 34.93,10.71
  Bottom 0.813: v40.01,7.62 v36.83,10.8
  pour Top (isolate 0.305, no thermals): 42.86,9.84 42.86,15.56 36.51,15.56 36.51,9.84
VMOT  (via drill 0.5)  (1 unrouted)
  Top 0.406: 40.88,31.48 41.53,30.83 46.73,30.83 47.38,31.48 U1.14 | 41.59,30.48 46.99,30.48 47.99,31.48 47.99,31.78 | 41.59,30.48 41.28,30.48 40.88,30.88 40.88,31.2 | U1.13 47.99,32.59 47.99,31.78 | 47.7,31.76 46.45,30.51 | U1.24 40.88,31.48 | 40.88,31.48 40.88,31.2 | 40.88,31.2 41.59,30.48 | 47.99,31.78 47.7,32.07
  Top 0.61: 53.98,12.55 D5.C | 50.8,5.39 C11.1
  Top 0.813: 53.66,11.11 54.61,12.07 54.61,12.21 D5.C 53.66,12.24 C11.1
  Top 1.016: D5.C 54.12,17 50.8,20.32 49.85,20.32 | 49.85,20.32 48.26,20.32 | 48.26,20.32 C12.+ | v47.7,33.66 47.7,32.07 47.7,31.76 | v47.7,22.86 47.7,20.88 48.26,20.32 | 49.85,20.32 C4.1
  Bottom 1.016: v47.7,33.66 v47.7,22.86 v47.7,21.59
  pour Top (isolate 0.305, no thermals): 46.04,23.18 48.26,23.18 48.26,21.59 49.53,20.32 46.04,20.32
(copper drawn outside any net)
  shapes: Top area x522

### Text on the board
Bottom: TON-BOT V1.1
tPlace: LiPo 1S | I | I | O | O
bPlace: default | default | alternate | alternate | Licensed under CERN OHL v.1.2
tDocu: TON-BOT V1.1 by IOTON Technology. / Licensed under CERN OHL v.1.2. / http://ohwr.org/cernohl